# EAGLE schematic 4*Vibrationdriver_MSP430 (EAGLE 7.2.0)
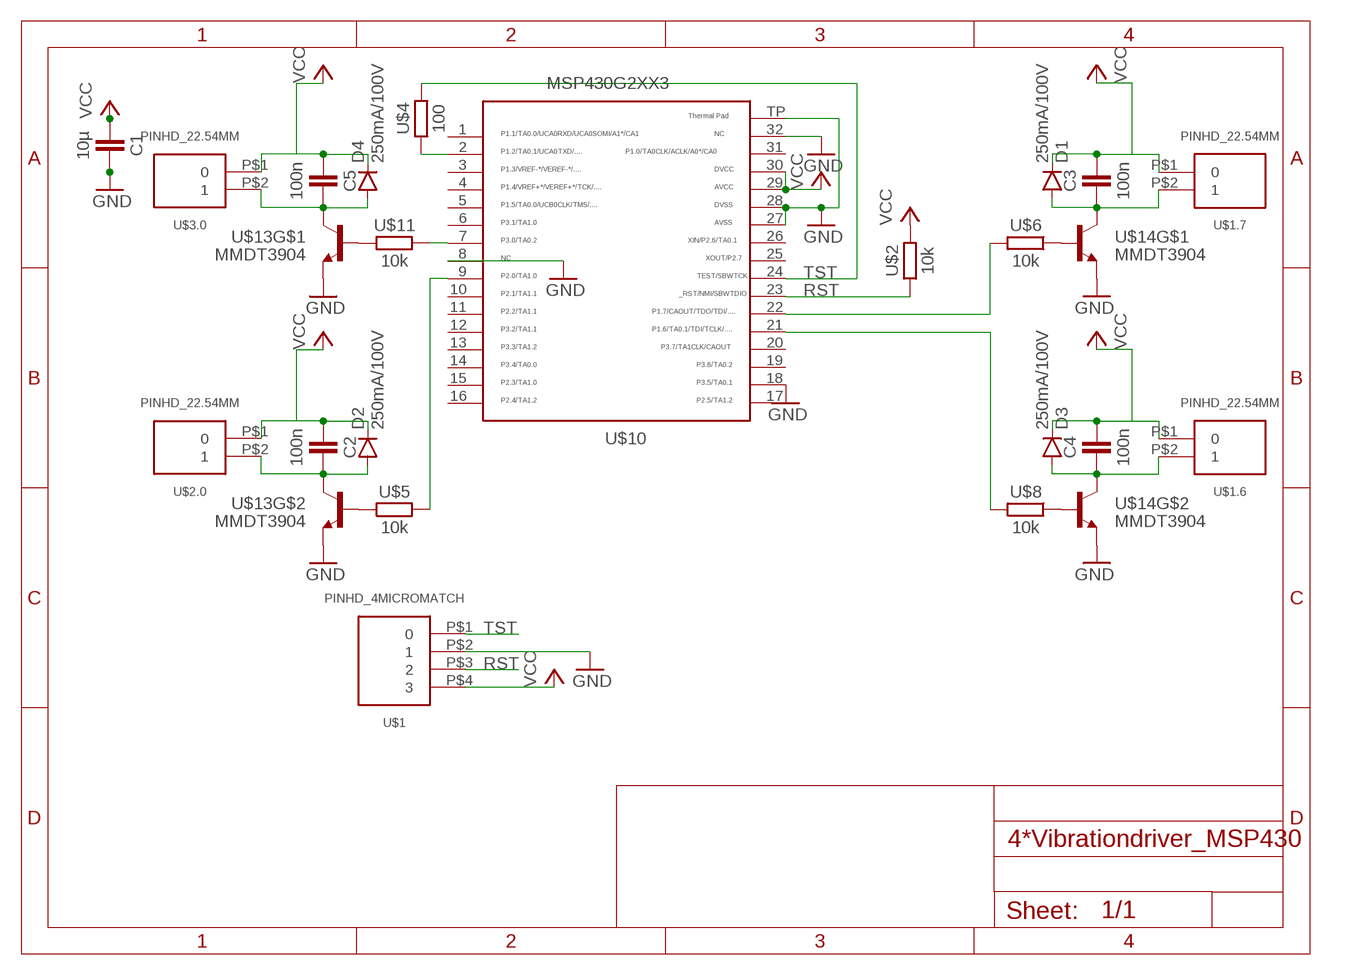
[diagram p0: schematic, sheet 1]

## Parts
C1  10µ  CAPACITOR  [603]
C2  100n  CAPACITOR  [603]
C3  100n  CAPACITOR  [603]
C4  100n  CAPACITOR  [603]
C5  100n  CAPACITOR  [603]
D1  250mA/100V  DIODEBAS16  [SOD-323]
D2  250mA/100V  DIODEBAS16  [SOD-323]
D3  250mA/100V  DIODEBAS16  [SOD-323]
D4  250mA/100V  DIODEBAS16  [SOD-323]
U$1  PINHD_4MICROMATCH  [MICROMATCH4P0L]
U$1.6  PINHD_22.54MM  [PINHD2]
U$1.7  PINHD_22.54MM  [PINHD2]
U$2  10k  RESISTOR0603  [603]
U$2.0  PINHD_22.54MM  [PINHD2]
U$3.0  PINHD_22.54MM  [PINHD2]
U$4  100  RESISTOR0603  [603]
U$5  10k  RESISTOR0603  [603]
U$6  10k  RESISTOR0603  [603]
U$8  10k  RESISTOR0603  [603]
U$10  MSP430G2553  [QFN32]
U$11  10k  RESISTOR0603  [603]
U$13  MMDT3904  TRANSISTOR_NPN2UPMMDT3904  [SOT363]
U$14  MMDT3904  TRANSISTOR_NPN2UPMMDT3904  [SOT363]

## Nets
GND: C1.2 U$1.P$2 U$10.8 U$10.18 U$10.27 U$10.28 U$10.32 U$10.TP U$13.1(E) U$13.4(E) U$14.1(E) U$14.4(E)
N$2: C2.2 D2.A U$2.0.P$2 U$13.3(C)
N$3: U$6.1 U$14.2(B)
N$4: C3.2 D1.A U$1.7.P$2 U$14.6(C)
N$5: U$5.1 U$13.5(B)
N$6: U$11.1 U$13.2(B)
N$11: U$4.1 U$10.2
N$13: U$6.2 U$10.22
N$14: U$8.1 U$14.5(B)
N$16: C4.2 D3.A U$1.6.P$2 U$14.3(C)
N$18: U$8.2 U$10.21
N$19: U$5.2 U$10.9
N$20: C5.2 D4.A U$3.0.P$2 U$13.6(C)
N$22: U$10.7 U$11.2
RST: U$1.P$3 U$2.1 U$10.23
TST: U$1.P$1 U$4.2 U$10.24
VCC: C1.1 C2.1 C3.1 C4.1 C5.1 D1.C D2.C D3.C D4.C U$1.6.P$1 U$1.7.P$1 U$1.P$4 U$2.0.P$1 U$2.2 U$3.0.P$1 U$10.29 U$10.30
Unconnected: U$10.1 U$10.3 U$10.4 U$10.5 U$10.6 U$10.10 U$10.11 U$10.12 U$10.13 U$10.14 U$10.15 U$10.16 U$10.17 U$10.19 U$10.20 U$10.25 U$10.26 U$10.31

## Library data of the parts
C1-C5 = thar:CAPACITOR
D1-D4 = SparkFun-DiscreteSemi:DIODE: Diode These are standard reverse protection diodes and small signal diodes. SMA package can handle up to about 1A. SOD-323 can handle about 200mA. What the SOD-323 package when ordering, there are some mfgs out there that are 5-pin packages.; PROD_ID: DIO-09646
U$1 = thar:PINHD_4
U$1.6 U$1.7 U$2.0 U$3.0 = thar:PINHD_2
U$2 U$4-U$6 U$8 U$11 = thar:RESISTOR
U$10 = thar:MSP430G2553: TEXAS INSTRUMENTS MSP430G2553IRHB32R MCU, 16BIT, MSP430, 16MHZ, QFN-32 Farnell Best.Nr.: 2325726 Herst.Bez.: MSP430G2553IRHB32R
U$13 U$14 = SparkFun-DiscreteSemi:TRANSISTOR_NPN2UP: 2-up package of NPN transistors MMDT3904- TRANS-09373 (SOT-363, 200mA 40V); PROD_ID: TRANS-09373